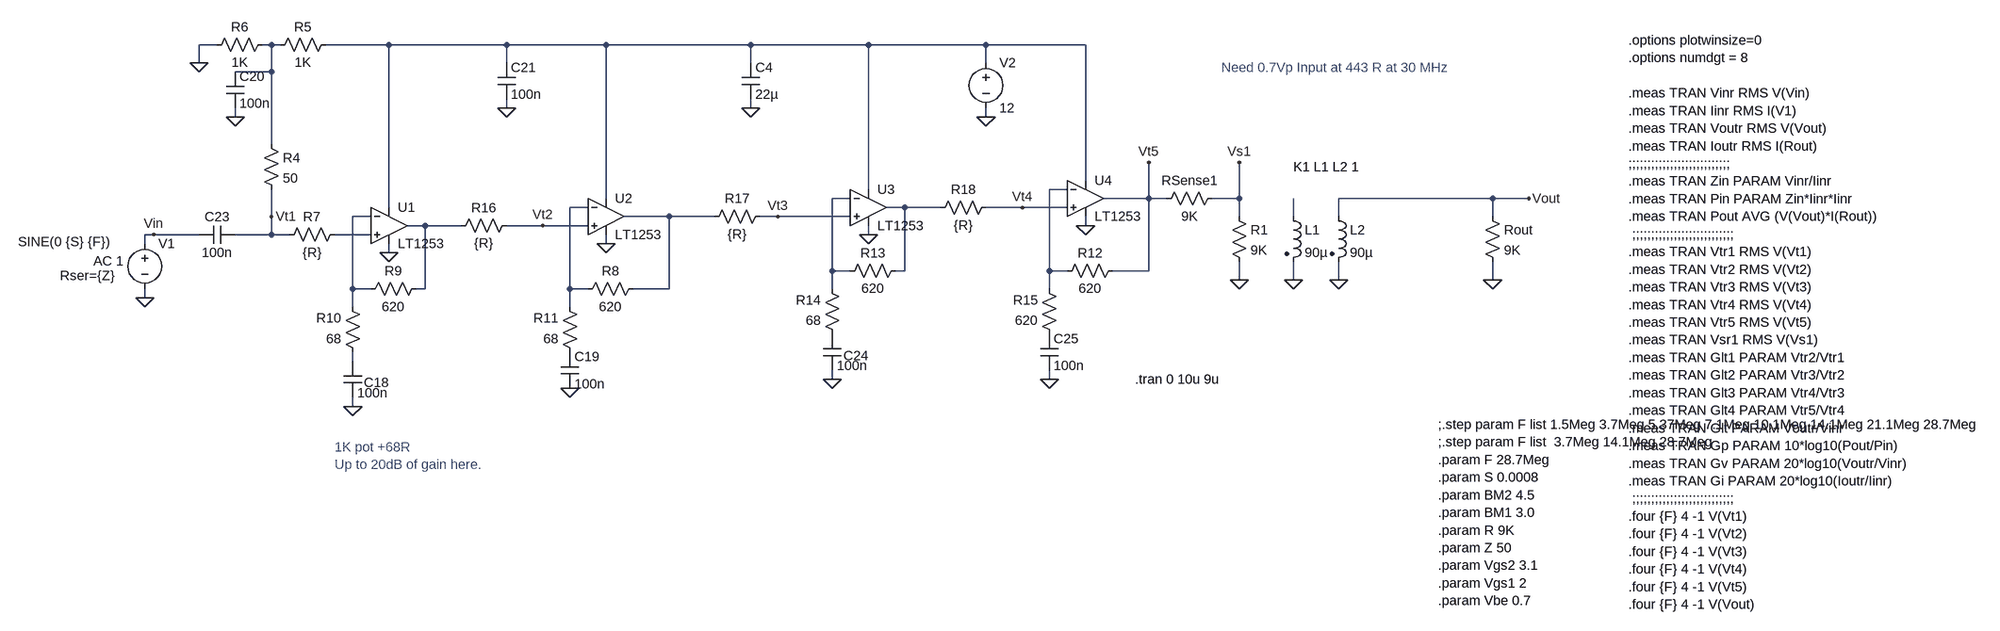
[diagram p0: schematic LT1253 Pre Amp.asc]
LT1253 Pre Amp.asc, the LTspice schematic file:
Version 4
SHEET 1 3136 1620
WIRE -2864 -176 -2896 -176
WIRE -2768 -176 -2784 -176
WIRE -2752 -176 -2768 -176
WIRE -2560 -176 -2672 -176
WIRE -2352 -176 -2560 -176
WIRE -2176 -176 -2352 -176
WIRE -1920 -176 -2176 -176
WIRE -1712 -176 -1920 -176
WIRE -1504 -176 -1712 -176
WIRE -1328 -176 -1504 -176
WIRE -2896 -144 -2896 -176
WIRE -2352 -144 -2352 -176
WIRE -1920 -144 -1920 -176
WIRE -1504 -144 -1504 -176
WIRE -2768 -128 -2768 -176
WIRE -2768 -128 -2832 -128
WIRE -2352 -64 -2352 -80
WIRE -1920 -64 -1920 -80
WIRE -2832 -48 -2832 -64
WIRE -1504 -48 -1504 -64
WIRE -2768 0 -2768 -128
WIRE -1328 64 -1328 -176
WIRE -1712 80 -1712 -176
WIRE -1360 80 -1392 80
WIRE -2176 96 -2176 -176
WIRE -1744 96 -1776 96
WIRE -1216 96 -1216 32
WIRE -1216 96 -1296 96
WIRE -1184 96 -1216 96
WIRE -1056 96 -1056 32
WIRE -1056 96 -1104 96
WIRE -608 96 -880 96
WIRE -544 96 -608 96
WIRE -2560 112 -2560 -176
WIRE -2208 112 -2240 112
WIRE -1648 112 -1680 112
WIRE -1584 112 -1648 112
WIRE -1440 112 -1504 112
WIRE -1360 112 -1440 112
WIRE -2768 128 -2768 80
WIRE -2592 128 -2624 128
WIRE -2064 128 -2144 128
WIRE -1984 128 -2064 128
WIRE -1872 128 -1904 128
WIRE -1744 128 -1872 128
WIRE -1056 128 -1056 96
WIRE -960 128 -960 96
WIRE -880 128 -880 96
WIRE -608 128 -608 96
WIRE -2496 144 -2528 144
WIRE -2432 144 -2496 144
WIRE -2288 144 -2352 144
WIRE -2208 144 -2288 144
WIRE -1328 144 -1328 128
WIRE -2976 160 -2992 160
WIRE -2896 160 -2976 160
WIRE -2768 160 -2768 128
WIRE -2768 160 -2832 160
WIRE -2736 160 -2768 160
WIRE -2592 160 -2656 160
WIRE -1712 160 -1712 144
WIRE -2992 176 -2992 160
WIRE -2176 176 -2176 160
WIRE -2560 192 -2560 176
WIRE -1776 224 -1776 96
WIRE -1744 224 -1776 224
WIRE -1648 224 -1648 112
WIRE -1648 224 -1664 224
WIRE -1392 224 -1392 80
WIRE -1360 224 -1392 224
WIRE -1216 224 -1216 96
WIRE -1216 224 -1280 224
WIRE -1056 240 -1056 208
WIRE -960 240 -960 208
WIRE -880 240 -880 208
WIRE -608 240 -608 208
WIRE -2624 256 -2624 128
WIRE -2592 256 -2624 256
WIRE -2496 256 -2496 144
WIRE -2496 256 -2512 256
WIRE -2240 256 -2240 112
WIRE -2208 256 -2240 256
WIRE -2064 256 -2064 128
WIRE -2064 256 -2128 256
WIRE -1776 256 -1776 224
WIRE -1392 256 -1392 224
WIRE -2992 272 -2992 256
WIRE -2624 288 -2624 256
WIRE -2240 288 -2240 256
WIRE -2624 384 -2624 368
WIRE -1776 416 -1776 400
WIRE -1392 416 -1392 400
WIRE -2624 464 -2624 448
FLAG -608 240 0
FLAG -544 96 Vout
FLAG -2992 272 0
FLAG -2976 160 Vin
FLAG -2352 -64 0
FLAG -2832 -48 0
FLAG -2560 192 0
FLAG -2176 176 0
FLAG -2240 432 0
FLAG -2896 -144 0
FLAG -2624 464 0
FLAG -1712 160 0
FLAG -1328 144 0
FLAG -1392 416 0
FLAG -1776 416 0
FLAG -1056 32 Vs1
FLAG -2768 128 Vt1
FLAG -2288 144 Vt2
FLAG -1872 128 Vt3
FLAG -1216 32 Vt5
FLAG -1440 112 Vt4
FLAG -1504 -48 0
FLAG -1920 -64 0
FLAG -880 240 0
FLAG -960 240 0
FLAG -1056 240 0
SYMBOL res -624 112 R0
SYMATTR InstName Rout
SYMATTR Value 9K
SYMBOL voltage -2992 160 R0
WINDOW 123 -91 47 Left 2
WINDOW 39 -150 73 Left 2
WINDOW 3 -224 13 Left 2
SYMATTR Value2 AC 1
SYMATTR SpiceLine Rser={Z}
SYMATTR Value SINE(0 {S} {F})
SYMATTR InstName V1
SYMBOL Opamps\\LT1253 -2560 80 R0
SYMATTR InstName U1
SYMBOL Opamps\\LT1253 -2176 64 R0
SYMATTR InstName U2
SYMBOL res -2784 -16 R0
SYMATTR InstName R4
SYMATTR Value 50
SYMBOL res -2656 -192 R90
WINDOW 0 0 56 VBottom 2
WINDOW 3 32 56 VTop 2
SYMATTR InstName R5
SYMATTR Value 1K
SYMBOL res -2768 -192 R90
WINDOW 0 0 56 VBottom 2
WINDOW 3 32 56 VTop 2
SYMATTR InstName R6
SYMATTR Value 1K
SYMBOL res -2640 144 R90
WINDOW 0 0 56 VBottom 2
WINDOW 3 32 56 VTop 2
SYMATTR InstName R7
SYMATTR Value {R}
SYMBOL res -2112 240 R90
WINDOW 0 0 56 VBottom 2
WINDOW 3 32 56 VTop 2
SYMATTR InstName R8
SYMATTR Value 620
SYMBOL res -2496 240 R90
WINDOW 0 0 56 VBottom 2
WINDOW 3 32 56 VTop 2
SYMATTR InstName R9
SYMATTR Value 620
SYMBOL res -2608 384 R180
WINDOW 0 36 76 Left 2
WINDOW 3 36 40 Left 2
SYMATTR InstName R10
SYMATTR Value 68
SYMBOL res -2224 384 R180
WINDOW 0 36 76 Left 2
WINDOW 3 36 40 Left 2
SYMATTR InstName R11
SYMATTR Value 68
SYMBOL cap -2640 384 R0
WINDOW 0 36 38 Left 2
SYMATTR InstName C18
SYMATTR Value 100n
SYMBOL cap -2256 368 R0
SYMATTR InstName C19
SYMATTR Value 100n
SYMBOL cap -2848 -128 R0
SYMATTR InstName C20
SYMATTR Value 100n
SYMBOL cap -2368 -144 R0
SYMATTR InstName C21
SYMATTR Value 100n
SYMBOL cap -2832 144 R90
WINDOW 0 0 32 VBottom 2
WINDOW 3 32 32 VTop 2
SYMATTR InstName C23
SYMATTR Value 100n
SYMBOL Opamps\\LT1253 -1712 48 R0
SYMATTR InstName U3
SYMBOL Opamps\\LT1253 -1328 32 R0
SYMATTR InstName U4
SYMBOL res -1264 208 R90
WINDOW 0 0 56 VBottom 2
WINDOW 3 32 56 VTop 2
SYMATTR InstName R12
SYMATTR Value 620
SYMBOL res -1648 208 R90
WINDOW 0 0 56 VBottom 2
WINDOW 3 32 56 VTop 2
SYMATTR InstName R13
SYMATTR Value 620
SYMBOL res -1760 352 R180
WINDOW 0 36 76 Left 2
WINDOW 3 36 40 Left 2
SYMATTR InstName R14
SYMATTR Value 68
SYMBOL res -1376 352 R180
WINDOW 0 36 76 Left 2
WINDOW 3 36 40 Left 2
SYMATTR InstName R15
SYMATTR Value 620
SYMBOL cap -1792 336 R0
WINDOW 0 36 38 Left 2
SYMATTR InstName C24
SYMATTR Value 100n
SYMBOL cap -1408 336 R0
SYMATTR InstName C25
SYMATTR Value 100n
SYMBOL res -2336 128 R90
WINDOW 0 0 56 VBottom 2
WINDOW 3 32 56 VTop 2
SYMATTR InstName R16
SYMATTR Value {R}
SYMBOL res -1888 112 R90
WINDOW 0 0 56 VBottom 2
WINDOW 3 32 56 VTop 2
SYMATTR InstName R17
SYMATTR Value {R}
SYMBOL res -1488 96 R90
WINDOW 0 0 56 VBottom 2
WINDOW 3 32 56 VTop 2
SYMATTR InstName R18
SYMATTR Value {R}
SYMBOL res -1200 112 R270
WINDOW 0 32 56 VTop 2
WINDOW 3 0 56 VBottom 2
SYMATTR InstName RSense1
SYMATTR Value 9K
SYMBOL voltage -1504 -160 R0
WINDOW 123 0 0 Left 0
WINDOW 39 0 0 Left 0
SYMATTR InstName V2
SYMATTR Value 12
SYMBOL cap -1936 -144 R0
SYMATTR InstName C4
SYMATTR Value 22µ
SYMBOL res -1072 112 R0
SYMATTR InstName R1
SYMATTR Value 9K
SYMBOL ind2 -976 112 R0
SYMATTR InstName L1
SYMATTR Value 90µ
SYMATTR Type ind
SYMBOL ind2 -896 112 R0
SYMATTR InstName L2
SYMATTR Value 90µ
SYMATTR Type ind
TEXT -1240 416 Left 2 !.tran 0 10u 9u
TEXT -368 -184 Left 2 !.options plotwinsize=0\n.options numdgt = 8\n \n.meas TRAN Vinr RMS V(Vin)\n.meas TRAN Iinr RMS I(V1)\n.meas TRAN Voutr RMS V(Vout)\n.meas TRAN Ioutr RMS I(Rout)\n;;;;;;;;;;;;;;;;;;;;;;;;;;;\n.meas TRAN Zin PARAM Vinr/Iinr\n.meas TRAN Pin PARAM Zin*Iinr*Iinr\n.meas TRAN Pout AVG (V(Vout)*I(Rout))\n ;;;;;;;;;;;;;;;;;;;;;;;;;;;\n.meas TRAN Vtr1 RMS V(Vt1)\n.meas TRAN Vtr2 RMS V(Vt2)\n.meas TRAN Vtr3 RMS V(Vt3)\n.meas TRAN Vtr4 RMS V(Vt4)\n.meas TRAN Vtr5 RMS V(Vt5)\n.meas TRAN Vsr1 RMS V(Vs1)\n.meas TRAN Glt1 PARAM Vtr2/Vtr1\n.meas TRAN Glt2 PARAM Vtr3/Vtr2\n.meas TRAN Glt3 PARAM Vtr4/Vtr3\n.meas TRAN Glt4 PARAM Vtr5/Vtr4\n.meas TRAN Glt PARAM Voutr/Vinr\n.meas TRAN Gp PARAM 10*log10(Pout/Pin)\n.meas TRAN Gv PARAM 20*log10(Voutr/Vinr)\n.meas TRAN Gi PARAM 20*log10(Ioutr/Iinr)\n ;;;;;;;;;;;;;;;;;;;;;;;;;;;\n.four {F} 4 -1 V(Vt1)\n.four {F} 4 -1 V(Vt2)\n.four {F} 4 -1 V(Vt3)\n.four {F} 4 -1 V(Vt4)\n.four {F} 4 -1 V(Vt5)\n.four {F} 4 -1 V(Vout)
TEXT -704 496 Left 2 !;.step param F list 1.5Meg 3.7Meg 5.37Meg 7.1Meg 10.1Meg 14.1Meg 21.1Meg 28.7Meg\n;.step param F list  3.7Meg 14.1Meg 28.7Meg\n.param F 28.7Meg\n.param S 0.0008\n.param BM2 4.5\n.param BM1 3.0\n.param R 9K\n.param Z 50\n.param Vgs2 3.1\n.param Vgs1 2\n.param Vbe 0.7
TEXT -1088 -136 Left 2 ;Need 0.7Vp Input at 443 R at 30 MHz
TEXT -2656 536 Left 2 ;1K pot +68R  \nUp to 20dB of gain here.
TEXT -960 40 Left 2 !K1 L1 L2 1

The netlist it stands for:
* LT1253 Pre Amp.asc
Rout Vout 0 9K
V1 Vin 0 SINE(0 {S} {F}) AC 1 Rser={Z}
XU1 N011 N007 N002 0 N010 LT1253  ; pins In+ In- V+ V- OUT
XU2 Vt2 N005 N002 0 N008 LT1253  ; pins In+ In- V+ V- OUT
R4 N001 Vt1 50
R5 N002 N001 1K
R6 N001 0 1K
R7 N011 Vt1 {R}
R8 N008 N005 620
R9 N010 N007 620
R10 N012 N007 68
R11 P001 N005 68
C18 N012 0 100n
C19 P001 0 100n
C20 N001 0 100n
C21 N002 0 100n
C23 Vt1 Vin 100n
XU3 Vt3 N004 N002 0 N006 LT1253  ; pins In+ In- V+ V- OUT
XU4 Vt4 N003 N002 0 Vt5 LT1253  ; pins In+ In- V+ V- OUT
R12 Vt5 N003 620
R13 N006 N004 620
R14 P002 N004 68
R15 P003 N003 620
C24 P002 0 100n
C25 P003 0 100n
R16 Vt2 N010 {R}
R17 Vt3 N008 {R}
R18 Vt4 N006 {R}
RSense1 Vt5 Vs1 9K
V2 N002 0 12
C4 N002 0 22µ
R1 Vs1 0 9K
L1 N009 0 90µ
L2 Vout 0 90µ
.tran 0 10u 9u
.options plotwinsize=0
.options numdgt = 8
.meas TRAN Vinr RMS V(Vin)
.meas TRAN Iinr RMS I(V1)
.meas TRAN Voutr RMS V(Vout)
.meas TRAN Ioutr RMS I(Rout)
;;;;;;;;;;;;;;;;;;;;;;;;;;;
.meas TRAN Zin PARAM Vinr/Iinr
.meas TRAN Pin PARAM Zin*Iinr*Iinr
.meas TRAN Pout AVG (V(Vout)*I(Rout))
 ;;;;;;;;;;;;;;;;;;;;;;;;;;;
.meas TRAN Vtr1 RMS V(Vt1)
.meas TRAN Vtr2 RMS V(Vt2)
.meas TRAN Vtr3 RMS V(Vt3)
.meas TRAN Vtr4 RMS V(Vt4)
.meas TRAN Vtr5 RMS V(Vt5)
.meas TRAN Vsr1 RMS V(Vs1)
.meas TRAN Glt1 PARAM Vtr2/Vtr1
.meas TRAN Glt2 PARAM Vtr3/Vtr2
.meas TRAN Glt3 PARAM Vtr4/Vtr3
.meas TRAN Glt4 PARAM Vtr5/Vtr4
.meas TRAN Glt PARAM Voutr/Vinr
.meas TRAN Gp PARAM 10*log10(Pout/Pin)
.meas TRAN Gv PARAM 20*log10(Voutr/Vinr)
.meas TRAN Gi PARAM 20*log10(Ioutr/Iinr)
 ;;;;;;;;;;;;;;;;;;;;;;;;;;;
.four {F} 4 -1 V(Vt1)
.four {F} 4 -1 V(Vt2)
.four {F} 4 -1 V(Vt3)
.four {F} 4 -1 V(Vt4)
.four {F} 4 -1 V(Vt5)
.four {F} 4 -1 V(Vout)
;.step param F list 1.5Meg 3.7Meg 5.37Meg 7.1Meg 10.1Meg 14.1Meg 21.1Meg 28.7Meg
;.step param F list  3.7Meg 14.1Meg 28.7Meg
.param F 28.7Meg
.param S 0.0008
.param BM2 4.5
.param BM1 3.0
.param R 9K
.param Z 50
.param Vgs2 3.1
.param Vgs1 2
.param Vbe 0.7
* Need 0.7Vp Input at 443 R at 30 MHz
* 1K pot +68R
* Up to 20dB of gain here.
K1 L1 L2 1
.backanno
.end